# Altium schematic sheet Power.SchDoc
size A; SheetNumber: 5; SheetTotal: 8
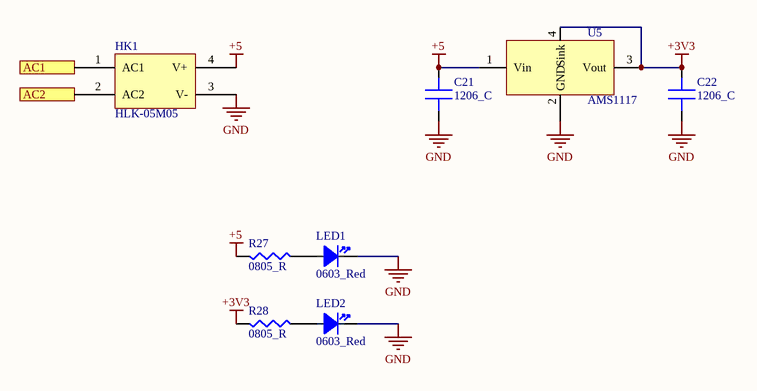
[diagram p0: Power.SchDoc]

## Parts
C21  1206_C  [1206]
C22  1206_C  [1206]
HK1  HLK-05M05  [HLK-05M05]
LED1  0603_Red  [0603_LED]
LED2  0603_Red  [0603_LED]
R27  0805_R  [R0805]
R28  0805_R  [R0805]
U5  AMS1117  [SOT-223]

## Ports
AC1 (in), AC2 (in)

## Nets
+3V3: C22.2 R28.1 U5.3(Vout) U5.4(Sink)
+5: C21.2 HK1.4(V+) R27.1 U5.1(Vin)
GND: C21.1 C22.1 HK1.3(V-) LED1.2(Cathode) LED2.2(Cathode) U5.2(GND)
AC1: HK1.1(AC1) ; port AC1
AC2: HK1.2(AC2) ; port AC2
NetLED1_1: LED1.1(Anode) R27.2
NetLED2_1: LED2.1(Anode) R28.2

## Library data of the parts
C21 C22 = 1206 Capacitor
LED1 LED2 = 0603LED
R27 R28 = 0805 Resistor
U5 = AMS1117 - 3V3: AMS1117-3.3 Checked Fixed Positive LDO Regulator, 3.3V, 1.3V Dropout, PDSO3 Voltage Regulators - Linear